# Altium project ADS805.PrjPcb
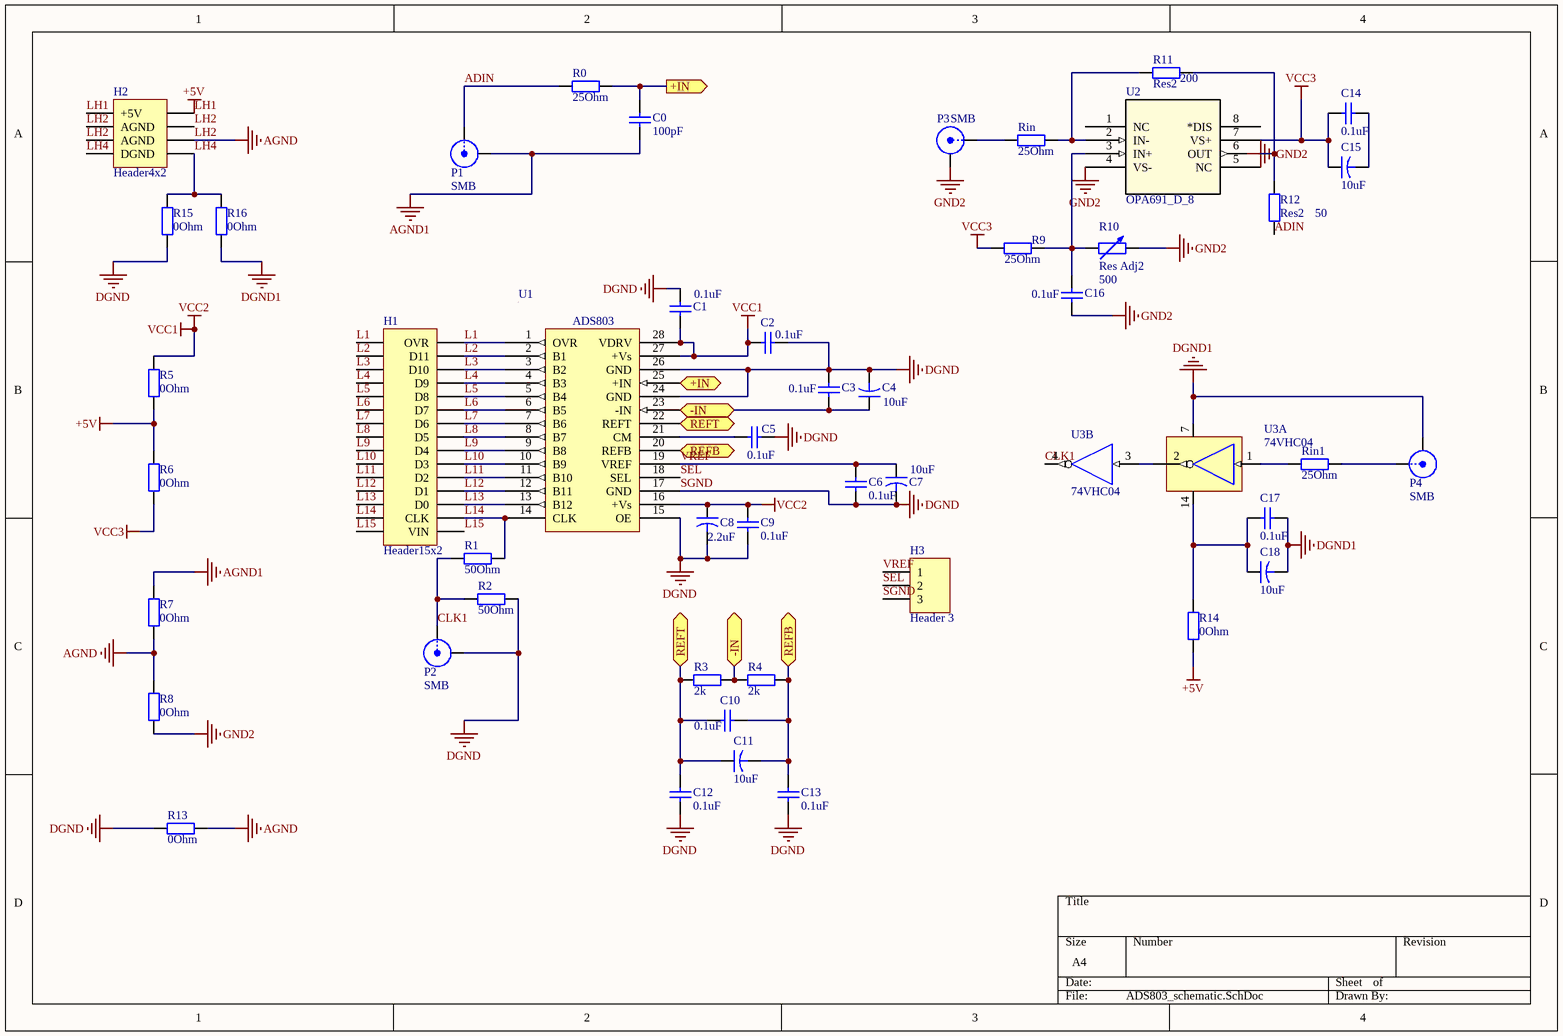
[diagram p0: ADS803_schematic.SchDoc]
1 sheet, 48 parts. Net scope: flat (ports and power ports of the same name join across sheets).
Board file: ADS805.PcbDoc

## Sheet ADS803_schematic.SchDoc
size A4

### Parts
C0  100pF  [C0805]
C1  0.1uF  [C0805]
C2  0.1uF  [C0805]
C3  0.1uF  [C0805]
C4  10uF  [CAP_SMD_3216]
C5  0.1uF  [C0805]
C6  0.1uF  [C0805]
C7  10uF  [CAP_SMD_3216]
C8  2.2uF  [CAP_SMD_3216]
C9  0.1uF  [C0805]
C10  0.1uF  [C0805]
C11  10uF  [CAP_SMD_3216]
C12  0.1uF  [C0805]
C13  0.1uF  [C0805]
C14  0.1uF  [C0805]
C15  10uF  [CAP_SMD_3216]
C16  0.1uF  [C0805]
C17  0.1uF  [C0805]
C18  10uF  [CAP_SMD_3216]
H1  Header15x2  [HDR2X15H]
H2  Header4x2  [HDR2X4H]
H3  Header 3  [Pin3]
P1  SMB  [SMB_V-RJ45]
P2  SMB  [SMB_V-RJ45]
P3  SMB  [SMB_V-RJ45]
P4  SMB  [SMB_V-RJ45]
R0  25Ohm  [6-0805_N]
R1  50Ohm  [6-0805_N]
R2  50Ohm  [6-0805_N]
R3  2k  [6-0805_N]
R4  2k  [6-0805_N]
R5  0Ohm  [6-0805_N]
R6  0Ohm  [6-0805_N]
R7  0Ohm  [6-0805_N]
R8  0Ohm  [6-0805_N]
R9  25Ohm  [6-0805_N]
R10  Res Adj2  value 500  [PRS_POT]
R11  Res2  value 200  [6-0805_N]
R12  Res2  value 50  [6-0805_N]
R13  0Ohm  [6-0805_N]
R14  0Ohm  [6-0805_N]
R15  0Ohm  [6-0805_N]
R16  0Ohm  [6-0805_N]
Rin  25Ohm  [6-0805_N]
Rin1  25Ohm  [6-0805_N]
U1  ADS803  [DB0028A_N]
U2  OPA691_D_8  [D8]
U3  74VHC04  [DIP-P14]  (parts A,B of 6)

### Ports
+IN (in), +IN (out), -IN (bidir), REFB (bidir), REFT (bidir)

### Nets
AGND1: C0.1 P1.2(Y) R7.2
DGND1: C17.1 C18.2 P4.2(Y) R16.1 U3.7(GND)
GND2: C16.1 P3.2(Y) R8.1 R10.2 U2.4(VS-)
LH1: H2.1(+5V) H2.2 R5.1 R6.2 R14.1  [also labelled +5V]
LH2: H2.3(AGND) H2.4 H2.5(AGND) H2.6 R7.1 R8.2 R13.1  [also labelled AGND]
SGND: C1.2 C2.2 C3.2 C4.2 C5.2 C6.2 C7.2 C8.2 C9.2 C12.1 C13.1 H3.3 P2.2(Y) R2.1 R13.2 R15.1 U1.15(OE) U1.17(GND) U1.24(GND) U1.26(GND)  [also labelled DGND]
VCC1: C1.1 C2.1 C8.1 C9.1 R5.2 U1.16(+Vs) U1.27(+Vs) U1.28(VDRV)  [also labelled VCC2]
VCC3: C14.2 C15.1 R6.1 R9.1 U2.7(VS+)
ADIN: P1.1(X) R0.1 R12.1
CLK1: P2.1(X) R1.2 R2.2 U3.4(Y)
L1: H1.1 H1.2(OVR) U1.1(OVR)
L2: H1.3 H1.4(D11) U1.2(B1)
L3: H1.5 H1.6(D10) U1.3(B2)
L4: H1.7 H1.8(D9) U1.4(B3)
L5: H1.9 H1.10(D8) U1.5(B4)
L6: H1.11 H1.12(D7) U1.6(B5)
L7: H1.13 H1.14(D6) U1.7(B6)
L8: H1.15 H1.16(D5) U1.8(B7)
L9: H1.17 H1.18(D4) U1.9(B8)
L10: H1.19 H1.20(D3) U1.10(B9)
L11: H1.21 H1.22(D2) U1.11(B10)
L12: H1.23 H1.24(D1) U1.12(B11)
L13: H1.25 H1.26(D0) U1.13(B12)
L14: H1.27 H1.28(CLK) R1.1 U1.14(CLK)
L15: H1.29 H1.30(VIN)
LH4: H2.7(DGND) H2.8 R15.2 R16.2
SEL: H3.2 U1.18(SEL)
VREF: C6.1 C7.1 H3.1 U1.19(VREF)
NetC0_2: C0.2 R0.2 U1.25(+IN) ; port +IN
NetC3_1: C3.1 C4.1 R3.2 R4.1 U1.23(-IN) ; port -IN
NetC5_1: C5.1 U1.21(CM)
NetC10_1: C10.1 C11.1 C12.2 R3.1 U1.22(REFT) ; port REFT
NetC10_2: C10.2 C11.2 C13.2 R4.2 U1.20(REFB) ; port REFB
NetC14_1: C14.1 C15.2
NetC16_2: C16.2 R9.2 R10.1 U2.3(IN+)
NetC17_2: C17.2 C18.1 R14.2 U3.14(VCC)
NetP3_1: P3.1(X) Rin.1
NetP4_1: P4.1(X) Rin1.2
NetR11_1: R11.1 Rin.2 U2.2(IN-)
NetR11_2: R11.2 R12.2 U2.6(OUT)
NetRin1_1: Rin1.1 U3.1(A)
NetU3_2: U3.2(Y) U3.3(A)

Not connected (* = marked no-connect by the designer): U2 1(NC) 5(NC) 8(*DIS)

### Notes on the sheet
- Labels drawn without touching a wire or pin: GND2

### Library data of the parts
C0-C3 C5 C6 C9 C10 C12-C14 C16 C17 = Cap1
C4 C7 C8 C11 C15 C18 = Cap2
H3 = Header 3: Header, 3-Pin; LatestRevisionDate: 17-Jul-2002; LatestRevisionNote: Re-released for DXP Platform.; Publisher: Altium Limited
P1-P4 = SMB: SMB Straight Connector; LatestRevisionDate: 17-Jul-2002; LatestRevisionNote: Re-released for DXP Platform.; Publisher: Altium Limited
R0-R9 R13-R16 Rin Rin1 = RES1
R10 = Res Adj2: Variable Resistor; Set Position: 0.5; Published: 8-Jun-2000; LatestRevisionDate: 17-Jul-2002; LatestRevisionNote: Re-released for DXP Platform.; PackageReference: AXIAL-0.6; Publisher: Altium Limited; PackageDescription: Axial Device, Thru-Hole; 2 Leads; 0.6 in Pin Spacing
R11 R12 = Res2: Resistor; Published: 8-Jun-2000; LatestRevisionDate: 17-Jul-2002; LatestRevisionNote: Re-released for DXP Platform.; PackageReference: AXIAL-0.4; Publisher: Altium Limited; PackageDescription: Axial Device, Thru-Hole; 2 Leads; 0.4 in Pin Spacing
U2 = OPA691_D_8: Imported; Manufacturer: Texas Instruments; GENERIC_PART_NUMBER: OPA691; INDUSTRY_STD_PKG_TYPE: SOIC; FAMILY_NAME: CURRENT FEEDBACK; PIN_COUNT: 8; PACKAGE_DESIGNATOR: D; Datasheet_URL: http://www.ti.com/lit/gpn/OPA691; Vendor: Texas Instruments; Manufacturer_Part_Number: opa691_d_8; Value: Value; Type: Type; RefDes: RefDes
U3 = 74VHC04: 非门; IC_Technology: S; Published: 17-Jul-2002; LatestRevisionDate: 13-Apr-2006; LatestRevisionNote: IPC-7351 Footprint Added.; DatasheetVersion: Mar-1998; PackageVersion: 2000; PackageReference: M14A; Publisher: Altium Limited; PackageDescription: 14-Pin Small Outline Integrated Circuit 1.27 mm Pitch; Code_IPC: SOIC127P600-14; ComponentLink1Description: Manufacturer Link; ComponentLink1URL: http://www.fairchildsemi.com/